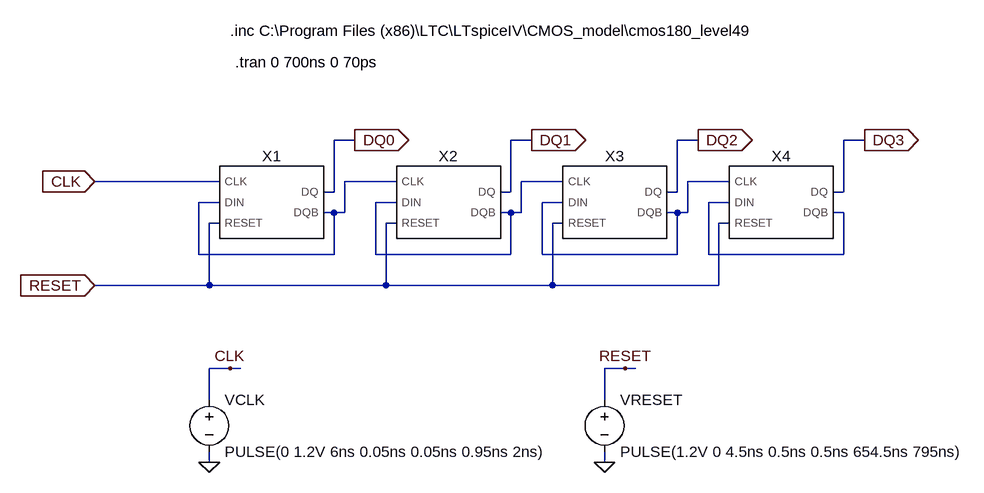
[diagram p0: schematic Lab2-2.asc]
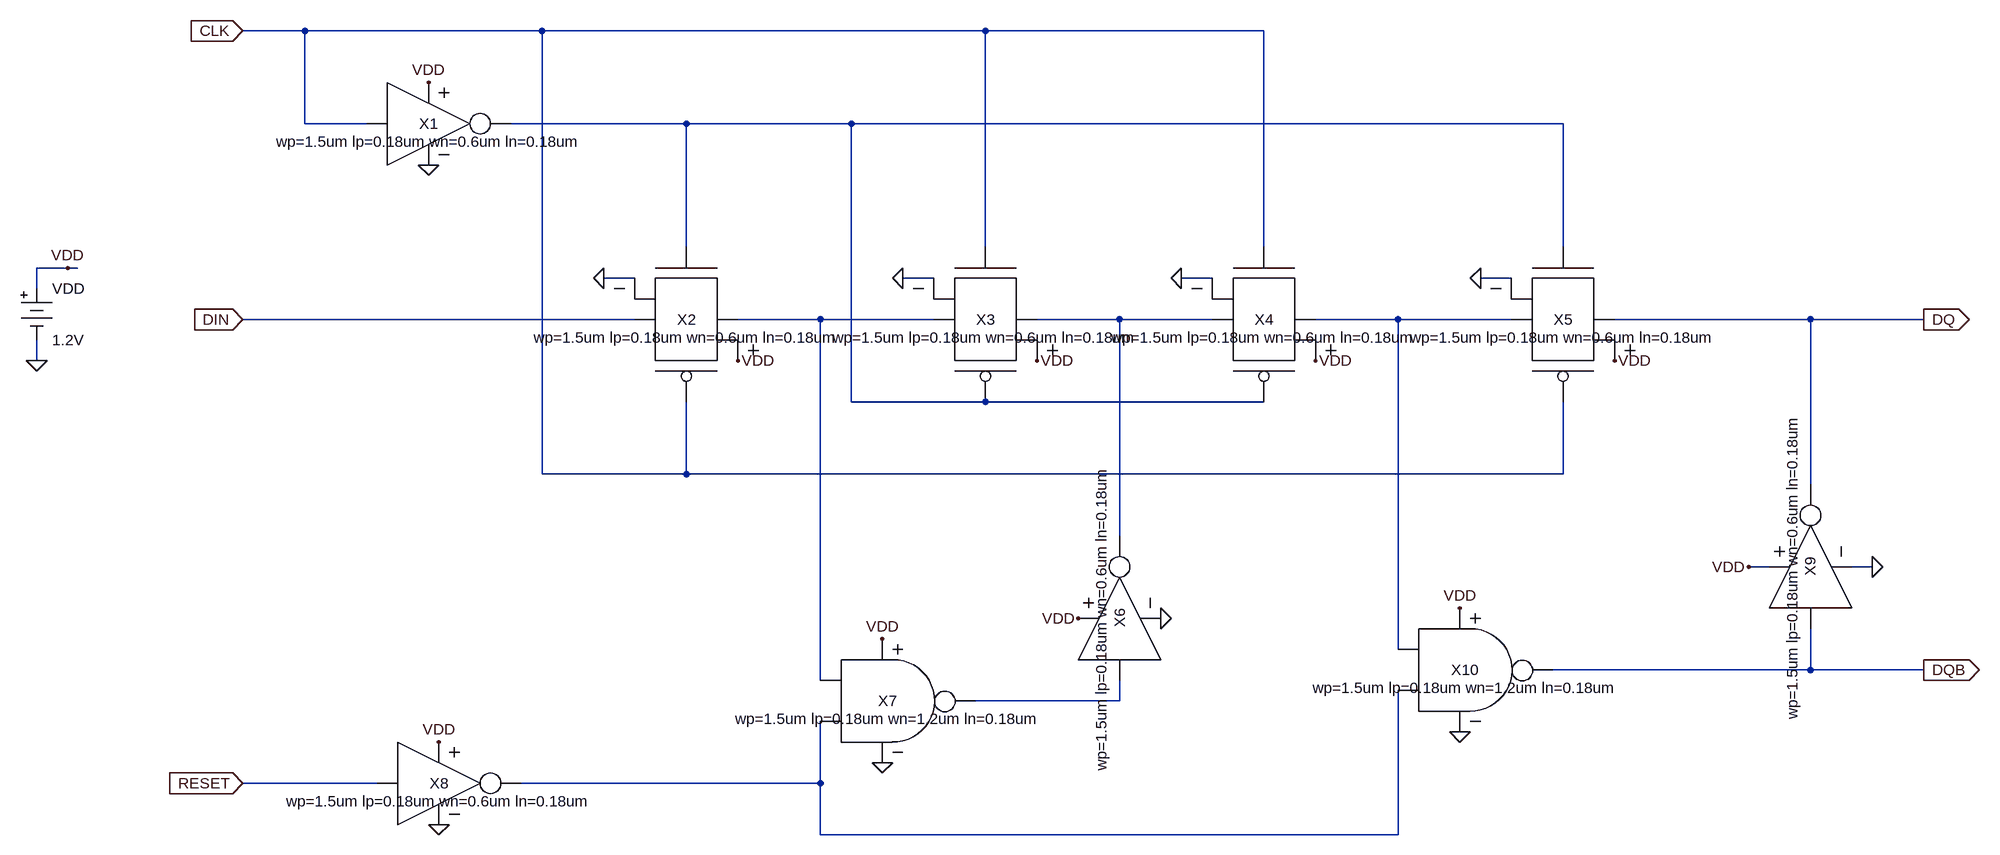
[diagram p1: sub-circuit dff.asc]
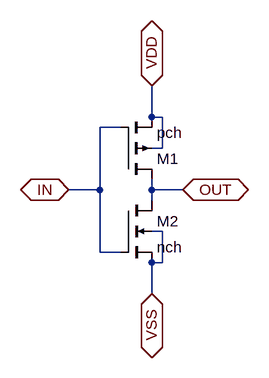
[diagram p2: sub-circuit inv.asc]
Lab2-2.asc, the LTspice schematic file:
Version 4
SHEET 1 1240 680
WIRE 224 64 192 64
WIRE 496 64 464 64
WIRE 752 64 720 64
WIRE 1008 64 976 64
WIRE 16 128 -176 128
WIRE 288 128 208 128
WIRE 544 128 480 128
WIRE 800 128 736 128
WIRE 192 144 192 64
WIRE 192 144 176 144
WIRE 464 144 464 64
WIRE 464 144 448 144
WIRE 720 144 720 64
WIRE 720 144 704 144
WIRE 976 144 976 64
WIRE 976 144 960 144
WIRE 16 160 -16 160
WIRE 288 160 256 160
WIRE 544 160 512 160
WIRE 800 160 768 160
WIRE 192 176 176 176
WIRE 208 176 208 128
WIRE 208 176 192 176
WIRE 464 176 448 176
WIRE 480 176 480 128
WIRE 480 176 464 176
WIRE 720 176 704 176
WIRE 736 176 736 128
WIRE 736 176 720 176
WIRE 976 176 960 176
WIRE 16 192 0 192
WIRE 288 192 272 192
WIRE 544 192 528 192
WIRE 800 192 784 192
WIRE -16 240 -16 160
WIRE 192 240 192 176
WIRE 192 240 -16 240
WIRE 256 240 256 160
WIRE 464 240 464 176
WIRE 464 240 256 240
WIRE 512 240 512 160
WIRE 720 240 720 176
WIRE 720 240 512 240
WIRE 768 240 768 160
WIRE 976 240 976 176
WIRE 976 240 768 240
WIRE 0 288 0 192
WIRE 0 288 -176 288
WIRE 272 288 272 192
WIRE 272 288 0 288
WIRE 528 288 528 192
WIRE 528 288 272 288
WIRE 784 288 784 192
WIRE 784 288 528 288
WIRE 32 416 0 416
WIRE 48 416 32 416
WIRE 640 416 608 416
WIRE 656 416 640 416
WIRE 0 464 0 416
WIRE 608 464 608 416
WIRE 0 560 0 544
WIRE 608 560 608 544
FLAG -176 128 CLK
IOPIN -176 128 In
FLAG -176 288 RESET
IOPIN -176 288 In
FLAG 224 64 DQ0
IOPIN 224 64 Out
FLAG 496 64 DQ1
IOPIN 496 64 Out
FLAG 752 64 DQ2
IOPIN 752 64 Out
FLAG 1008 64 DQ3
IOPIN 1008 64 Out
FLAG 0 560 0
FLAG 608 560 0
FLAG 32 416 CLK
FLAG 640 416 RESET
SYMBOL DFF 96 160 R0
SYMATTR InstName X1
SYMBOL DFF 368 160 R0
SYMATTR InstName X2
SYMBOL DFF 624 160 R0
SYMATTR InstName X3
SYMBOL DFF 880 160 R0
SYMATTR InstName X4
SYMBOL voltage 0 448 R0
WINDOW 123 0 0 Left 2
WINDOW 39 0 0 Left 2
SYMATTR InstName VCLK
SYMATTR Value PULSE(0 1.2V 6ns 0.05ns 0.05ns 0.95ns 2ns)
SYMBOL voltage 608 448 R0
WINDOW 123 0 0 Left 2
WINDOW 39 0 0 Left 2
SYMATTR InstName VRESET
SYMATTR Value PULSE(1.2V 0 4.5ns 0.5ns 0.5ns 654.5ns 795ns)
TEXT 32 -104 Left 2 !.inc C:\\Program Files (x86)\\LTC\\LTspiceIV\\CMOS_model\\cmos180_level49
TEXT 40 -56 Left 2 !.tran 0 700ns 0 70ps

dff.asc, the sub-circuit schematic file:
Version 4
SHEET 1 2968 916
WIRE 336 -336 240 -336
WIRE 704 -336 336 -336
WIRE 1392 -336 704 -336
WIRE 1824 -336 1392 -336
WIRE 336 -192 336 -336
WIRE 432 -192 336 -192
WIRE 928 -192 656 -192
WIRE 1184 -192 928 -192
WIRE 2288 -192 1184 -192
WIRE 928 0 928 -192
WIRE 1392 0 1392 -336
WIRE 1824 0 1824 -336
WIRE 2288 0 2288 -192
WIRE -32 32 -80 32
WIRE -16 32 -32 32
WIRE 848 48 800 48
WIRE 1312 48 1264 48
WIRE 1744 48 1696 48
WIRE 2208 48 2160 48
WIRE -80 64 -80 32
WIRE 848 112 240 112
WIRE 1136 112 1008 112
WIRE 1312 112 1136 112
WIRE 1600 112 1472 112
WIRE 1744 112 1600 112
WIRE 2032 112 1904 112
WIRE 2208 112 2032 112
WIRE 2672 112 2368 112
WIRE 2848 112 2672 112
WIRE -80 176 -80 144
WIRE 1184 240 1184 -192
WIRE 1392 240 1184 240
WIRE 1824 240 1392 240
WIRE 704 352 704 -336
WIRE 928 352 928 240
WIRE 928 352 704 352
WIRE 2288 352 2288 240
WIRE 2288 352 928 352
WIRE 2672 368 2672 112
WIRE 1600 448 1600 112
WIRE 2608 496 2576 496
WIRE 2768 496 2736 496
WIRE 2032 624 2032 112
WIRE 2672 656 2672 592
WIRE 2672 656 2272 656
WIRE 2848 656 2672 656
WIRE 1136 672 1136 112
WIRE 1600 704 1600 672
WIRE 1600 704 1376 704
WIRE 448 832 240 832
WIRE 1136 832 1136 736
WIRE 1136 832 672 832
WIRE 1136 912 1136 832
WIRE 2032 912 2032 688
WIRE 2032 912 1136 912
FLAG -80 176 0
FLAG -32 32 VDD
FLAG 240 -336 CLK
IOPIN 240 -336 In
FLAG 528 -256 VDD
FLAG 528 -128 0
FLAG 1008 176 VDD
FLAG 1472 176 VDD
FLAG 1904 176 VDD
FLAG 2368 176 VDD
FLAG 1264 48 0
FLAG 1696 48 0
FLAG 2160 48 0
FLAG 800 48 0
FLAG 240 112 DIN
IOPIN 240 112 In
FLAG 2848 112 DQ
IOPIN 2848 112 Out
FLAG 2768 496 0
FLAG 2576 496 VDD
FLAG 1536 576 VDD
FLAG 1664 576 0
FLAG 1232 608 VDD
FLAG 544 768 VDD
FLAG 2128 560 VDD
FLAG 544 896 0
FLAG 1232 800 0
FLAG 2128 752 0
FLAG 2848 656 DQB
IOPIN 2848 656 Out
FLAG 240 832 RESET
IOPIN 240 832 In
SYMBOL Misc\\battery -80 48 R0
WINDOW 123 0 0 Left 2
WINDOW 39 0 0 Left 2
SYMATTR InstName VDD
SYMATTR Value 1.2V
SYMBOL trans 928 112 R180
WINDOW 39 0 -28 Center 2
SYMATTR InstName X2
SYMATTR SpiceLine wp=1.5um lp=0.18um wn=0.6um ln=0.18um
SYMBOL trans 1392 112 R180
WINDOW 39 0 -28 Center 2
SYMATTR InstName X3
SYMATTR SpiceLine wp=1.5um lp=0.18um wn=0.6um ln=0.18um
SYMBOL trans 1824 112 R180
WINDOW 39 0 -28 Center 2
SYMATTR InstName X4
SYMATTR SpiceLine wp=1.5um lp=0.18um wn=0.6um ln=0.18um
SYMBOL trans 2288 112 R180
WINDOW 39 0 -28 Center 2
SYMATTR InstName X5
SYMATTR SpiceLine wp=1.5um lp=0.18um wn=0.6um ln=0.18um
SYMBOL inv 1600 576 R270
WINDOW 39 0 -28 Center 2
SYMATTR InstName X6
SYMATTR SpiceLine wp=1.5um lp=0.18um wn=0.6um ln=0.18um
SYMBOL inv 528 -192 R0
WINDOW 39 0 28 Center 2
SYMATTR InstName X1
SYMATTR SpiceLine wp=1.5um lp=0.18um wn=0.6um ln=0.18um
SYMBOL inv 544 832 R0
WINDOW 39 0 28 Center 2
SYMATTR InstName X8
SYMATTR SpiceLine wp=1.5um lp=0.18um wn=0.6um ln=0.18um
SYMBOL nand2 1248 704 R0
WINDOW 39 -8 28 Center 2
SYMATTR InstName X7
SYMATTR SpiceLine wp=1.5um lp=0.18um wn=1.2um ln=0.18um
SYMBOL nand2 2144 656 R0
WINDOW 39 -8 28 Center 2
SYMATTR InstName X10
SYMATTR SpiceLine wp=1.5um lp=0.18um wn=1.2um ln=0.18um
SYMBOL inv 2672 496 R270
WINDOW 39 0 -28 Center 2
SYMATTR InstName X9
SYMATTR SpiceLine wp=1.5um lp=0.18um wn=0.6um ln=0.18um

inv.asc, the sub-circuit schematic file:
Version 4
SHEET 1 880 680
WIRE 240 32 240 -16
WIRE 256 32 240 32
WIRE 192 48 160 48
WIRE 256 80 256 32
WIRE 256 80 240 80
WIRE 160 144 160 48
WIRE 160 144 112 144
WIRE 240 144 240 128
WIRE 288 144 240 144
WIRE 240 160 240 144
WIRE 256 208 240 208
WIRE 160 240 160 144
WIRE 192 240 160 240
WIRE 256 256 256 208
WIRE 256 256 240 256
WIRE 240 304 240 256
FLAG 112 144 IN
IOPIN 112 144 BiDir
FLAG 288 144 OUT
IOPIN 288 144 BiDir
FLAG 240 -16 VDD
IOPIN 240 -16 BiDir
FLAG 240 304 VSS
IOPIN 240 304 BiDir
SYMBOL pmos4 192 128 M180
SYMATTR InstName M1
SYMATTR Value pch
SYMATTR Value2 l=lp w=wp
SYMBOL nmos4 192 160 R0
SYMATTR InstName M2
SYMATTR Value nch
SYMATTR Value2 l=ln w=wn

The netlist it stands for:
* Lab2-2.asc
XX1 CLK N001 RESET DQ0 N001 dff
XX2 N001 N002 RESET DQ1 N002 dff
XX3 N002 N003 RESET DQ2 N003 dff
XX4 N003 N004 RESET DQ3 N004 dff
VCLK CLK 0 PULSE(0 1.2V 6ns 0.05ns 0.05ns 0.95ns 2ns)
VRESET RESET 0 PULSE(1.2V 0 4.5ns 0.5ns 0.5ns 654.5ns 795ns)

* block symbol definitions
.subckt dff CLK DIN RESET DQ DQB
VDD VDD 0 1.2V
XX2 N001 CLK DIN N002 VDD 0 trans params: wp=1.5um lp=0.18um wn=0.6um ln=0.18um  ; pins GN GP D S VDD VSS
XX3 CLK N001 N002 N003 VDD 0 trans params: wp=1.5um lp=0.18um wn=0.6um ln=0.18um  ; pins GN GP D S VDD VSS
XX4 CLK N001 N003 N004 VDD 0 trans params: wp=1.5um lp=0.18um wn=0.6um ln=0.18um  ; pins GN GP D S VDD VSS
XX5 N001 CLK N004 DQ VDD 0 trans params: wp=1.5um lp=0.18um wn=0.6um ln=0.18um  ; pins GN GP D S VDD VSS
XX6 N005 N003 VDD 0 inv params: wp=1.5um lp=0.18um wn=0.6um ln=0.18um
XX1 CLK N001 VDD 0 inv params: wp=1.5um lp=0.18um wn=0.6um ln=0.18um
XX8 RESET N006 VDD 0 inv params: wp=1.5um lp=0.18um wn=0.6um ln=0.18um
XX7 N002 N006 N005 VDD 0 nand2 params: wp=1.5um lp=0.18um wn=1.2um ln=0.18um  ; pins A B Y VDD VSS
XX10 N004 N006 DQB VDD 0 nand2 params: wp=1.5um lp=0.18um wn=1.2um ln=0.18um  ; pins A B Y VDD VSS
XX9 DQB DQ VDD 0 inv params: wp=1.5um lp=0.18um wn=0.6um ln=0.18um
.ends dff

.subckt inv IN OUT VDD VSS
M1 OUT IN VDD VDD pch l=lp w=wp
M2 OUT IN VSS VSS nch l=ln w=wn
.ends inv

.model NMOS NMOS
.model PMOS PMOS
.lib standard.mos
.inc C:\Program Files (x86)\LTC\LTspiceIV\CMOS_model\cmos180_level49
.tran 0 700ns 0 70ps
.backanno
.end

* Results of the author's LTspice run, read from the files saved beside the schematic
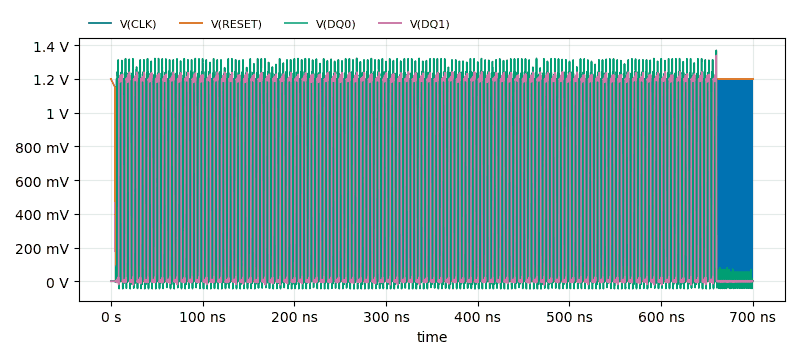
[diagram p3: Transient Analysis of Lab2-2.asc, plotted from the saved traces]
* Transient Analysis, 1 run:
*   V(CLK): min 0 V, max 1.2 V, average 594.9 mV, rms 838.3 mV, last 0 V
*   V(RESET): min 0 V, max 1.2 V, average 77.14 mV, rms 303.7 mV, last 1.2 V
*   V(DQ0): min -44.99 mV, max 1.4 V, average 547.3 mV, rms 800 mV, last 9.913 µV
*   V(DQ1): min -21.73 mV, max 1.339 V, average 553.2 mV, rms 809.6 mV, last 152.7 nV